# Altium schematic sheet Inverter.SchDoc (part 2 of 2)
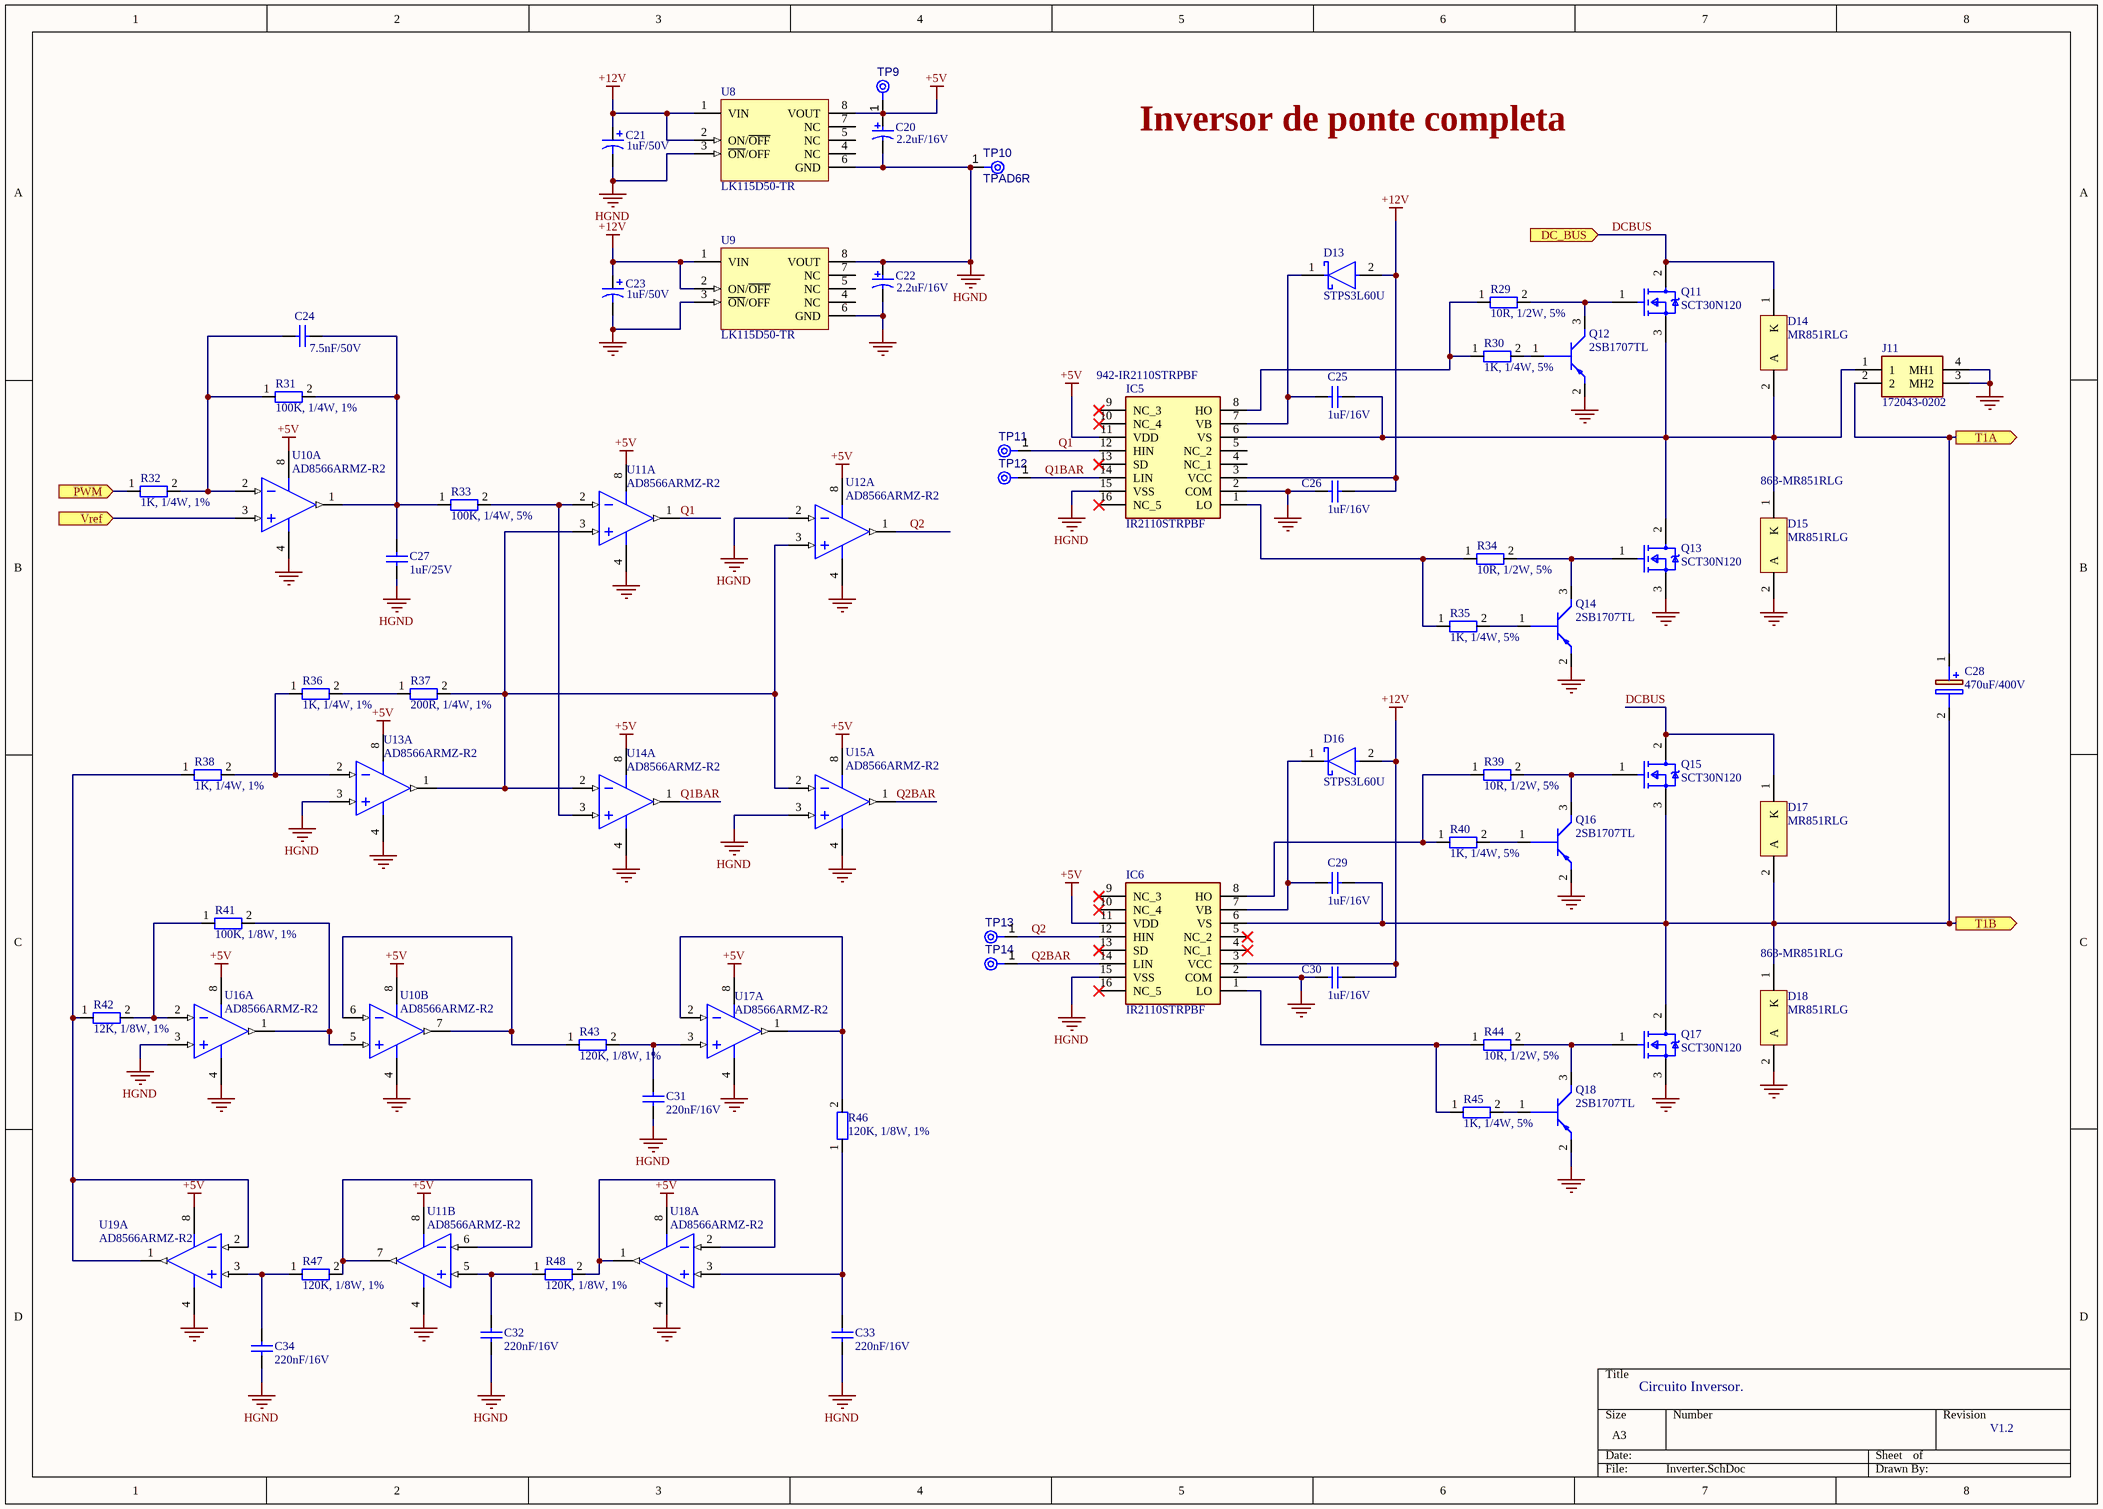
[diagram p1: Inverter.SchDoc]

## Library data of the parts
C20 C22 = CMP-2000-07187-1: Tantalum Capacitor, 2.2 uF, +/- 10%, 16 V, -55 to 125 degC, 2-Pin SMD, RoHS, Tape and Reel; Manufacturer: Kemet; Manufacturer Part Number: T491A225K016AT; Capacitance: 2200000pF; Product Depth (mm): 1.6mm; DCL: 0.4uA; Wire Form: NotRequired; Case Style: Molded; ESR: 6ohm; Polarity: Polar; Product Length (mm): 3.2mm; Voltage: 16VDC; Lead Spacing (nom): NotRequiredmm; DF: 6%; Rad Hardened: No; ESR (Equivalent Series Resistance): 6R; Voltage Rating: 16V; Life (Hours): 2000Hour; Leakage Current: 500nA; Operating Temp Range: -55Cto125C; Datasheet Version: 10/2016; Packaging: TapeandReel; Mounting Style: SurfaceMount; Manufacturer URL: http://www.kemet.com/; Seal: NotRequired; Product Height (mm): 1.6mm; Construction: SMTChip; Length W/Weld: NotRequiredmm; Package Reference: T491-A; Package Description: 2-Pin Surface Mount Device, Body 3.2 x 1.6 mm; Tolerance (+ or -): 10%; Length W/Weld (max): NotRequiredmm; Insulation: NotRequired; Mounting Technology: SurfaceMount; Package / Case: 3216-18; Seated Plane Height: NotRequiredmm; Case Code: A; Datasheet URL: http://capacitoredge.kemet.com/capedge2/DataSheet/Datasheet-T491A225K016AT.pdf?pn=T491A225K016AT; Product Diameter (mm): NotRequiredmm; Failure Rate: NotRequired; Supplier 1: Mouser; Supplier Part Number 1: 80-T491A225K016; RoHS: Yes; Category: Tantalum Capacitors; Stock 1: 27935; Pricing 1: 1=0.38000, 10=0.22000, 50=0.22000, 100=0.13300, 1000=0.10900, 10000=0.08000 (USD); Mount: Surface Mount,PCB; Case/Package: 1206; Number of Pins: 2; Case Code (Metric): 3216; Case Code (Imperial): 1206; Dielectric Material: Tantalum; Min Operating Temperature: -55°C; Max Operating Temperature: 125°C; Tolerance: 10%; Features: General Purpose; Dissipation Factor: 6%; Voltage Rating (DC): 16V; Termination: SMD/SMT; Package Quantity: 1; Length: 3.2mm; Width: 1.6mm; Height: 1.6mm; Depth: 1.6mm; Height - Seated (Max): 0.071inch; Radiation Hardening: No; Lead Free: Lead Free; RoHS Compliant: Yes; REACH SVHC: No SVHC; ComponentLink1URL: https://datasheet.ciiva.com/27052/1573329-27052562.pdf?src-supplier=Jameco; ComponentLink1Description: https://datasheet.ciiva.com/27052/1573329-27052562.pdf?src-supplier=Jameco; ComponentLink2URL: https://datasheet.ciiva.com/11793/0900766b80718482-11793333.pdf?src-supplier=RSComponents; ComponentLink2Description: https://datasheet.ciiva.com/11793/0900766b80718482-11793333.pdf?src-supplier=RSComponents; ComponentLink3URL: https://datasheet.ciiva.com/7696/1776109-7696304.pdf?src-supplier=Element14; ComponentLink3Description: https://datasheet.ciiva.com/7696/1776109-7696304.pdf?src-supplier=Element14; ComponentLink4URL: https://datasheet.ciiva.com/257/kem-t2005-t491-257413.pdf?src-supplier=Digi-Key; ComponentLink4Description: https://datasheet.ciiva.com/257/kem-t2005-t491-257413.pdf?src-supplier=Digi-Key; ComponentLink5URL: https://datasheet.ciiva.com/257/kem-t2005-t491-257414.pdf?src-supplier=Digi-Key; ComponentLink5Description: https://datasheet.ciiva.com/257/kem-t2005-t491-257414.pdf?src-supplier=Digi-Key; ComponentLink6URL: https://datasheet.ciiva.com/257/kem-t2005-t491-257415.pdf?src-supplier=Digi-Key; ComponentLink6Description: https://datasheet.ciiva.com/257/kem-t2005-t491-257415.pdf?src-supplier=Digi-Key; ComponentLink7URL: https://datasheet.ciiva.com/5934/1854511-5934533.pdf?src-supplier=Farnell; ComponentLink7Description: https://datasheet.ciiva.com/5934/1854511-5934533.pdf?src-supplier=Farnell; ComponentLink8URL: https://datasheet.ciiva.com/12910/kem-t2005-t491-12910990.pdf?src-supplier=Mouser; ComponentLink8Description: https://datasheet.ciiva.com/12910/kem-t2005-t491-12910990.pdf?src-supplier=Mouser; ComponentLink9URL: https://datasheet.ciiva.com/7696/1446014-7696302.pdf?src-supplier=Element14; ComponentLink9Description: https://datasheet.ciiva.com/7696/1446014-7696302.pdf?src-supplier=Element14; ComponentLink10URL: https://datasheet.ciiva.com/7696/1854511-7696303.pdf?src-supplier=Element14; ComponentLink10Description: https://datasheet.ciiva.com/7696/1854511-7696303.pdf?src-supplier=Element14; ComponentLink11URL: https://datasheet.ciiva.com/18095/getdatasheetpartid-120946-18095941.pdf?src-supplier=Verical; ComponentLink11Description: https://datasheet.ciiva.com/18095/getdatasheetpartid-120946-18095941.pdf?src-supplier=Verical
C21 C23 = Cap Pol1: KEMET         T491A105K050AT            Surface Mount Tantalum Capacitor, T491 Series, 1 F,  10%, 50 V, 1206 [3216 Metric], A; Capacitance: 1uF; ESR (Equivalent Series Resistance): 7R; Voltage Rating: 50V; Polarity: Polar; Dissipation Factor: 4%; Published: 8-Jun-2000; LatestRevisionDate: 17-Jul-2002; LatestRevisionNote: Re-released for DXP Platform.; PackageReference: RB7.6-15; Publisher: Altium Limited; PackageDescription: Polarized Capacitor (Radial); 2 Leads; Supplier 1: Mouser; Supplier Part Number 1: 80-T491A105K050AT; Manufacturer: KEMET; Manufacturer Part Number: T491A105K050AT; RoHS: Yes; Category: Tantalum Capacitors; Stock 1: 5526; Pricing 1: 1=0.86000, 10=0.53600, 50=0.53600, 100=0.37800, 1000=0.31600, 10000=0.24700 (USD); Case/Package: Molded; Case Code (Metric): 3216; Case Code (Imperial): 1206; Min Operating Temperature: -55°C; Max Operating Temperature: 125°C; Tolerance: 10%; Packaging: Cut Tape; Voltage Rating (DC): 50V; Length: 3.2mm; Depth: 1.6mm; REACH SVHC: No SVHC; Lead Free: Lead Free; RoHS Compliant: Yes; ComponentLink1URL: https://datasheet.ciiva.com/7972/1854511-7972911.pdf?src-supplier=Element14; ComponentLink1Description: https://datasheet.ciiva.com/7972/1854511-7972911.pdf?src-supplier=Element14
C24 = CMP-1036-04761-2: Manufacturer: Murata; Part Number: GRM21BR71H105KA12L; Manufacturer Part Number: C0805C752FAGAC7210; Capacitance: 7.5nF; Dielectric: C0G; Voltage Rating (DC): 250V; Tolerance: 1%; Supplier 1: Mouser; Supplier Part Number 1: 80-C0805C752FAG7210; RoHS: Yes; Category: Ceramic Capacitors; Case/Package: 0805; Case Code (Imperial): 0805; Case Code (Metric): 2012; Weight: 0.000194oz; Min Operating Temperature: -55°C; Max Operating Temperature: 125°C; Packaging: Tape and Reel; Termination: SMD/SMT; Package Quantity: 10000; Length: 2mm; Width: 1.2mm; RoHS Compliant: Yes; ComponentLink1URL: http://www.mouser.com/ds/2/212/KEM_C1003_C0G_SMD-356956.pdf?src-supplier=Mouser; ComponentLink1Description: http://www.mouser.com/ds/2/212/KEM_C1003_C0G_SMD-356956.pdf?src-supplier=Mouser
C25 C26 C29 C30 = CMP-2007-03241-1: Part Number: C0805C105Z4VACTU; Manufacturer: Kemet; Dielectric Material: Ceramic; Capacitance: 1uF; Voltage Rating: 16V; Tolerance: 80%; Dielectric: Y5V; Dissipation Factor: 7%; Supplier 1: Digi-Key; Supplier Part Number 1: 399-8011-1-ND; Manufacturer Part Number: C0805C105Z4VACTU; RoHS: Yes; Category: Ceramic Capacitors; Stock 1: 2421; Pricing 1: 1=0.11000, 10=0.08100, 50=0.04580, 100=0.03800, 500=0.02666, 1000=0.02207 (USD); Mount: Surface Mount,PCB; Case/Package: 0805; Number of Pins: 2; Case Code (Metric): 2012; Case Code (Imperial): 0805; Contact Material: Tin; Min Operating Temperature: -30°C; Max Operating Temperature: 85°C; Package Quantity: 1; Packaging: Tape and Reel; Voltage Rating (DC): 16V; Termination: SMD/SMT; Voltage: 16V; Series: C; Construction: Flat; Length: 2mm; Width: 0.049inch; Height: 1.25mm; Thickness: 0.055inch; Lead Pitch: 0.75mm; Depth: 1.25mm; Radiation Hardening: No; REACH SVHC: No SVHC; Lead Free: Lead Free; RoHS Compliant: Yes; ComponentLink1URL: https://datasheet.ciiva.com/6074/1698780-6074369.pdf?src-supplier=Farnell; ComponentLink1Description: https://datasheet.ciiva.com/6074/1698780-6074369.pdf?src-supplier=Farnell; ComponentLink2URL: https://datasheet.ciiva.com/16623/datasheetpn-c0805c105z4vac7800-16623623.pdf?src-supplier=Avnet+Europe; ComponentLink2Description: https://datasheet.ciiva.com/16623/datasheetpn-c0805c105z4vac7800-16623623.pdf?src-supplier=Avnet+Europe; ComponentLink3URL: https://datasheet.ciiva.com/14589/70095383-14589407.pdf?src-supplier=Allied+Electronics; ComponentLink3Description: https://datasheet.ciiva.com/14589/70095383-14589407.pdf?src-supplier=Allied+Electronics; ComponentLink4URL: https://datasheet.ciiva.com/7600/1698780-7600029.pdf?src-supplier=Newark; ComponentLink4Description: https://datasheet.ciiva.com/7600/1698780-7600029.pdf?src-supplier=Newark; ComponentLink5URL: https://datasheet.ciiva.com/14604/70095383-14604106.pdf?src-supplier=Allied+Electronics; ComponentLink5Description: https://datasheet.ciiva.com/14604/70095383-14604106.pdf?src-supplier=Allied+Electronics
C27 = CMP-1036-04761-2: Manufacturer: KEMET; Manufacturer Part Number: C0805C302K3GACTU; Dielectric Material: Ceramic; Capacitance: 3nF; Voltage Rating: 25V; Tolerance: 10%; Dielectric: C0G; Supplier 1: Newark; Supplier Part Number 1: 32K4910; RoHS: Yes; Category: Ceramic Capacitors; Pricing 1: 4000=0.15300, 8000=0.14600, 16000=0.14100, 24000=0.13600 (USD); Mount: Surface Mount; Case/Package: 0805; Case Code (Imperial): 0805; Case Code (Metric): 2012; Weight: 0.000194oz; Min Operating Temperature: -55°C; Max Operating Temperature: 125°C; Package Quantity: 4000; Packaging: Tape and Reel; Voltage Rating (DC): 25V; Termination: SMD/SMT; Series: C; Length: 2mm; Width: 1.25mm; Height: 0.9mm; Thickness: 0.039inch; Depth: 1.25mm; Lead Free: Lead Free; RoHS Compliant: Yes; ComponentLink1URL: http://www.mouser.com/ds/2/212/KEM_C1003_C0G_SMD-1101588.pdf?src-supplier=Mouser; ComponentLink1Description: http://www.mouser.com/ds/2/212/KEM_C1003_C0G_SMD-1101588.pdf?src-supplier=Mouser; ComponentLink2URL: http://components.arrow.com/part/dataview/3397846S8614754N7429?src-supplier=Arrow+Electronics; ComponentLink2Description: http://components.arrow.com/part/dataview/3397846S8614754N7429?src-supplier=Arrow+Electronics; ComponentLink3URL: https://search.kemet.com/component-edge/download/datasheet/C0805C302K3GACTU.pdf?src-supplier=Digi-Key; ComponentLink3Description: https://search.kemet.com/component-edge/download/datasheet/C0805C302K3GACTU.pdf?src-supplier=Digi-Key
C28 = MAL225966471E3: Capacitor Polarised; Manufacturer_Name: Vishay; Datasheet Link: https://ms.componentsearchengine.com/Datasheets/2/MAL225966471E3.pdf; Height: 37mm; Manufacturer_Part_Number: MAL225966471E3; Mouser Part Number: 594-MAL225966471E3; Mouser Price/Stock: https://www.mouser.co.uk/ProductDetail/Vishay-BC-Components/MAL225966471E3?qs=r5DSvlrkXmJ9zh5giZ1tYQ%3D%3D; Supplier 1: Mouser; Supplier Part Number 1: 594-MAL225966471E3; Manufacturer: Vishay; Manufacturer Part Number: MAL225966471E3; RoHS: Yes; Category: Aluminum Electrolytic Capacitors; Stock 1: 383; Pricing 1: 1=10.14000, 10=9.64000, 50=8.11000, 100=7.60000, 1000=6.33000, 10000=6.33000 (USD); RoHS Compliant: Yes
C31-C34 = CMP-1036-04761-2: Manufacturer: Murata; Part Number: GRM21BR71H105KA12L
D13 D16 = CMP-12187-000023-1: DIODE SCHOTTKY 60V 3A SMB; Manufacturer: STMicroelectronics; Standoff Height: 0.05mm; Peak Reverse Current: 150uA; Max Junction Temp: +150°C; Max Surge Forward Current: 100A; Element Configuration: Single; Forward Voltage: 790mV; Polarity: Standard; Octopart: https://octopart.com/stps3l60u-stmicroelectronics-334329; Category: Diode; Height: 2.65mm; RoHS: TRUE; Mouser Description: Schottky diode Configuration: Single Housing type: DO-214AA=SMB Peak conducting-state current: 100 A; Forward Current: 3A; Manufacturer Part Number: STPS3L60U; Temperature: to +150°C; ComponentLink2URL: https://www.st.com/resource/en/datasheet/stps3l60.pdf; Max Repetitive Reverse Voltage: 60V; Device Class L1: Discrete Semiconductors; Automotive: No; Device Class L3: Schottky Diodes; Digikey Description: DIODE SCHOTTKY 60V 3A SMB; Lead Free: Yes; Temperature Range High: +150°C; Package: SMB; ComponentLink2Description: Datasheet; Device Class L2: Diodes; Supplier 1: Mouser; Supplier Part Number 1: 511-STPS3L60U; Stock 1: 8303; Pricing 1: 1=0.43000, 10=0.33000, 50=0.33000, 100=0.20200, 1000=0.11900, 10000=0.10200 (USD); Mount: Surface Mount; Case/Package: SMB; Number of Pins: 2; Min Operating Temperature: -65°C; Max Operating Temperature: 150°C; Max Reverse Current: 150uA; Peak Non-Repetitive Surge Current: 100A; Max Repetitive Reverse Voltage (Vrrm): 60V; Packaging: Tape and Reel; Package Quantity: 1; Average Rectified Current: 3A; Max Reverse Voltage (DC): 60V; Max Reverse Leakage Current: 150uA; Max Forward Surge Current (Ifsm): 100A; Series: -; Max Surge Current: 100A; Voltage Rating (DC): 60V; Output Current: 3A; Current Rating: 3A; Length: 4.6mm; Width: 3.95mm; Radiation Hardening: No; RoHS Compliant: Yes; REACH SVHC: No SVHC; ComponentLink1URL: https://datasheet.ciiva.com/14178/cd00002286-14178423.pdf?src-supplier=Distrelec; ComponentLink1Description: https://datasheet.ciiva.com/14178/cd00002286-14178423.pdf?src-supplier=Distrelec; ComponentLink3URL: https://datasheet.ciiva.com/26788/stps3l60u-26788715.pdf?src-supplier=IIIC; ComponentLink3Description: https://datasheet.ciiva.com/26788/stps3l60u-26788715.pdf?src-supplier=IIIC; ComponentLink4URL: https://datasheet.ciiva.com/916/cd00002286-916102.pdf?src-supplier=Digi-Key; ComponentLink4Description: https://datasheet.ciiva.com/916/cd00002286-916102.pdf?src-supplier=Digi-Key; ComponentLink5URL: https://datasheet.ciiva.com/916/cd00002286-916103.pdf?src-supplier=Digi-Key; ComponentLink5Description: https://datasheet.ciiva.com/916/cd00002286-916103.pdf?src-supplier=Digi-Key; ComponentLink6URL: https://datasheet.ciiva.com/916/cd00002286-916104.pdf?src-supplier=Digi-Key; ComponentLink6Description: https://datasheet.ciiva.com/916/cd00002286-916104.pdf?src-supplier=Digi-Key; ComponentLink7URL: https://datasheet.ciiva.com/16491/cd00002286-16491535.pdf?src-supplier=Future+Electronics; ComponentLink7Description: https://datasheet.ciiva.com/16491/cd00002286-16491535.pdf?src-supplier=Future+Electronics; ComponentLink8URL: https://datasheet.ciiva.com/7963/1671123-7963959.pdf?src-supplier=Element14; ComponentLink8Description: https://datasheet.ciiva.com/7963/1671123-7963959.pdf?src-supplier=Element14; ComponentLink9URL: https://datasheet.ciiva.com/7963/1671123-7963960.pdf?src-supplier=Element14; ComponentLink9Description: https://datasheet.ciiva.com/7963/1671123-7963960.pdf?src-supplier=Element14; ComponentLink10URL: https://datasheet.ciiva.com/14560/70014075-14560118.pdf?src-supplier=Allied+Electronics; ComponentLink10Description: https://datasheet.ciiva.com/14560/70014075-14560118.pdf?src-supplier=Allied+Electronics
D14 D15 D17 D18 = CMP-0902-00056-1: Fast Recovery Rectifier, 2-Pin Axial_Lead, Pb-Free, Tape and Reel; Manufacturer: On Semiconductor; IO(rec) Max (A): 3; VRRM Max (V): 100; Max Surge Current: 100A; Max Reverse Current: 10uA; Forward Voltage: 1.25V; Recovery Time: 300ns; Forward Current: 3A; Max Repetitive Reverse Voltage (Vrrm): 100V; Element Configuration: Single; Polarity: Standard; ComponentLink1URL: http://www.onsemi.com/; PartNumber: MR851RLG; ComponentLink1Description: Manufacturer URL; ComponentLink2URL: http://www.onsemi.com/pub_link/Collateral/MR850-D.PDF; DatasheetVersion: Rev. 6; PackageDescription: 2-Pin, Axial Lead, Diameter 5.05 mm; ComponentLink3URL: http://www.onsemi.com/pub_link/Collateral/267-05.PDF; Type: Fast Recovery; IFSM Max (A): 100; ComponentLink3Description: Package Specification; PackageReference: AXIAL_LEAD-2-267-05; RoHS: TRUE; Mounting Technology: Through Hole; ComponentLink2Description: Datasheet; Packing: Tape and Reel; PackageVersion: Rev. G, 06/2000; Supplier 1: Mouser; Manufacturer Part Number: MR851RLG; Category: Rectifier Diodes; Stock 1: 3652; Pricing 1: 1=0.49000, 10=0.34400, 50=0.34400, 100=0.17400, 1000=0.15400, 10000=0.09200 (USD); Case/Package: DO-201AD; Number of Pins: 2; Weight: 0.01lb; Contact Plating: Tin,Matte; Min Operating Temperature: -65°C; Max Operating Temperature: 125°C; Package Quantity: 1; Packaging: Tape and Reel; Average Rectified Current: 3A; Reverse Recovery Time: 300ns; Peak Non-Repetitive Surge Current: 100A; Max Forward Surge Current (Ifsm): 100A; Voltage Rating (DC): 100V; Current Rating: 3A; Output Current: 3A; Max Reverse Voltage (DC): 100V; Reverse Voltage: 100V; Series: -; Reverse Recovery Time-Max: 300ns; Diameter: 5.3mm; Length: 0.374inch; Width: 1inch; Height: 9.5mm; Radiation Hardening: No; REACH SVHC: No SVHC; Lead Free: Lead Free; Halogen Free: Halogen Free; ComponentLink4URL: https://datasheet.ciiva.com/30479/0900766b812212e7-30479531.pdf?src-supplier=RSComponents; ComponentLink4Description: https://datasheet.ciiva.com/30479/0900766b812212e7-30479531.pdf?src-supplier=RSComponents; ComponentLink5URL: https://datasheet.ciiva.com/7963/92108-7963073.pdf?src-supplier=Element14; ComponentLink5Description: https://datasheet.ciiva.com/7963/92108-7963073.pdf?src-supplier=Element14; ComponentLink6URL: https://datasheet.ciiva.com/923/mr850-d-923098.pdf?src-supplier=Digi-Key; ComponentLink6Description: https://datasheet.ciiva.com/923/mr850-d-923098.pdf?src-supplier=Digi-Key; ComponentLink7URL: https://datasheet.ciiva.com/923/mr850-d-923099.pdf?src-supplier=Digi-Key; ComponentLink7Description: https://datasheet.ciiva.com/923/mr850-d-923099.pdf?src-supplier=Digi-Key
  D14 D17: Supplier Part Number 1: 863-MR851RLG
IC5 IC6 = IR2110STRPBF: MOSFET Driver 500 Volt 2.5A 2 Output Hi/Lo Side Non Input Volt 16-Pin SOIC W; Manufacturer_Name: Infineon; Manufacturer: International Rectifier; Number of Outputs: 2; Max Supply Voltage: 20V; Min Supply Voltage: 10V; Max Power Dissipation: 1.25W; Turn-On Delay Time: 10ns; Max Supply Current: 340uA; Rise Time: 35ns; Propagation Delay: 150ns; Fall Time: 25ns; Turn-Off Delay Time: 94ns; Output Voltage: 520V; Datasheet Link: https://www.infineon.com/dgdl/Infineon-IR2110-DataSheet-v01_00-EN.pdf?fileId=5546d462533600a4015355c80333167e; Height: 2.65mm; Manufacturer_Part_Number: IR2110STRPBF; Mouser Part Number: 942-IR2110STRPBF; Mouser Price/Stock: https://www.mouser.co.uk/ProductDetail/Infineon-IR/IR2110STRPBF?qs=2r01AXMCG3P4pNuJUqFzxg%3D%3D; Arrow Part Number: IR2110STRPBF; Arrow Price/Stock: https://www.arrow.com/en/products/ir2110strpbf/infineon-technologies-ag; Supplier 1: Mouser; Manufacturer Part Number: IR2110STRPBF; RoHS: Yes; Category: Gate Drivers; Pricing 1: 1=2.60000, 10=2.20000, 50=2.20000, 100=1.54000, 1000=1.18000, 10000=1.18000 (USD); Mount: Surface Mount; Case/Package: SOIC; Number of Pins: 16; Min Operating Temperature: -40°C; Max Operating Temperature: 125°C; Packaging: Tape and Reel; Max Output Current: 2.5A; Package Quantity: 1000; Number of Drivers: 2; Power Dissipation: 1.25W; Series: -; Output Current: 2.5A; Nominal Supply Current: 340uA; Max Output Voltage: 20V; Min Output Voltage: 10V; Termination: SMD/SMT; Length: 10.5mm; Width: 7.6mm; Radiation Hardening: No; Lead Free: Lead Free; REACH SVHC: No SVHC; ComponentLink1URL: https://datasheet.ciiva.com/1952/ir2110-1952809.pdf?src-supplier=Digi-Key; ComponentLink1Description: https://datasheet.ciiva.com/1952/ir2110-1952809.pdf?src-supplier=Digi-Key; ComponentLink2URL: https://datasheet.ciiva.com/1952/ir2110-1952810.pdf?src-supplier=Digi-Key; ComponentLink2Description: https://datasheet.ciiva.com/1952/ir2110-1952810.pdf?src-supplier=Digi-Key; ComponentLink3URL: https://datasheet.ciiva.com/1952/ir2110-1952811.pdf?src-supplier=Digi-Key; ComponentLink3Description: https://datasheet.ciiva.com/1952/ir2110-1952811.pdf?src-supplier=Digi-Key; ComponentLink4URL: https://datasheet.ciiva.com/3226/ir2110-3226294.pdf?src-supplier=Avnet; ComponentLink4Description: https://datasheet.ciiva.com/3226/ir2110-3226294.pdf?src-supplier=Avnet; ComponentLink5URL: https://datasheet.ciiva.com/16298/ir2110-16298071.pdf?src-supplier=Future+Electronics; ComponentLink5Description: https://datasheet.ciiva.com/16298/ir2110-16298071.pdf?src-supplier=Future+Electronics; ComponentLink6URL: https://datasheet.ciiva.com/1499/81026-1499491.pdf?src-supplier=Element14; ComponentLink6Description: https://datasheet.ciiva.com/1499/81026-1499491.pdf?src-supplier=Element14; ComponentLink7URL: https://datasheet.ciiva.com/28366/81026-28366141.pdf?src-supplier=Element14; ComponentLink7Description: https://datasheet.ciiva.com/28366/81026-28366141.pdf?src-supplier=Element14; ComponentLink8URL: https://datasheet.ciiva.com/22694/81026-22694331.pdf?src-supplier=Element14; ComponentLink8Description: https://datasheet.ciiva.com/22694/81026-22694331.pdf?src-supplier=Element14
  IC6: Supplier Part Number 1: 942-IR2110STRPBF
J11 = 172043-0202: CONN HDR 2POS 7.50MM R/A SLDR; Manufacturer_Name: Molex; Number of Positions: 2; Voltage Rating: 600V; Current Rating: 30A; Pitch: 0.295inch; Datasheet Link: https://www.molex.com/pdm_docs/sd/1720430202_sd.pdf; Height: 11.68mm; Manufacturer_Part_Number: 172043-0202; Mouser Part Number: 538-172043-0202; Mouser Price/Stock: https://www.mouser.co.uk/ProductDetail/Molex/172043-0202?qs=AUG1J5sL7zJwcA2Oseq0RA%3D%3D; Supplier 1: Mouser; Supplier Part Number 1: 538-172043-0202; Manufacturer: Molex; Manufacturer Part Number: 1720430202; RoHS: Yes; Category: Cables and Wire; Stock 1: 939; Pricing 1: 1=2.21000, 10=1.89000, 50=1.89000, 100=1.56000, 1000=1.22000, 10000=1.08000 (USD); Mount: Through Hole; Number of Pins: 2; Color: Black; Contact Material: Copper; Contact Plating: Silver; Insulation Material: Polymer; Min Operating Temperature: -40°C; Max Operating Temperature: 125°C; Packaging: Tray; Number of Rows: 1; Termination: Solder; Fastening Type: Ramp; Orientation: Right Angle; Number of Circuits: 2; RoHS Compliant: Yes; ComponentLink1URL: https://www.mouser.com/ds/2/276/1720430202_PCB_HEADERS-704499.pdf?src-supplier=Mouser; ComponentLink1Description: https://www.mouser.com/ds/2/276/1720430202_PCB_HEADERS-704499.pdf?src-supplier=Mouser; ComponentLink2URL: http://www.molex.com/pdm_docs/sd/1720430202_sd.pdf?src-supplier=Avnet; ComponentLink2Description: http://www.molex.com/pdm_docs/sd/1720430202_sd.pdf?src-supplier=Avnet; ComponentLink3URL: http://www.literature.molex.com/SQLImages/kelmscott/Molex/PDF_Images/987650-1349.PDF?src-supplier=Digi-Key; ComponentLink3Description: http://www.literature.molex.com/SQLImages/kelmscott/Molex/PDF_Images/987650-1349.PDF?src-supplier=Digi-Key; ComponentLink4URL: http://www.molex.com/pdm_docs/sd/1720430202_sd.pdf?src-supplier=Digi-Key; ComponentLink4Description: http://www.molex.com/pdm_docs/sd/1720430202_sd.pdf?src-supplier=Digi-Key
Q11 Q13 Q15 Q17 = SCT30N120: Trans MOSFET N-CH 1.2KV 45A 3-Pin HIP-247 Tube; Manufacturer: STMicroelectronics; Continuous Drain Current (ID): 40A; Rds On Max: 100mR; Input Capacitance: 1.7nF; Max Power Dissipation: 270W; Gate to Source Voltage (Vgs): 25V; Element Configuration: Single; Number of Channels: 1; Drain to Source Resistance: 80mR; Fall Time: 28ns; Rise Time: 20ns; Turn-Off Delay Time: 45ns; Turn-On Delay Time: 19ns; Threshold Voltage: 2.6V; Power Dissipation: 175W; Supplier 1: Digi-Key; Manufacturer Part Number: SCT30N120; RoHS: Yes; Category: MOSFETs; Stock 1: 580; Pricing 1: 1=21.25000, 10=19.53200, 25=18.72200, 100=16.49560, 500=16.10000 (USD); Mount: Through Hole; Case/Package: TO-247-3; Number of Pins: 247; Weight: 1.340411oz; Min Operating Temperature: -55°C; Max Operating Temperature: 200°C; Drain to Source Voltage (Vdss): 1.2kV; Packaging: Rail/Tube; Drain to Source Breakdown Voltage: 1.2kV; Package Quantity: 30; Number of Elements: 1; Lead Free: Lead Free; REACH SVHC: No SVHC; ComponentLink1URL: https://datasheet.ciiva.com/46422/1856099-46422059.pdf?src-supplier=Element14; ComponentLink1Description: https://datasheet.ciiva.com/46422/1856099-46422059.pdf?src-supplier=Element14; Supplier Part Number 1: 497-14960-ND
Q12 Q14 Q16 Q18 = 2SB1707TL: TRANS PNP 12V 4A TSMT3; Manufacturer_Name: ROHM Semiconductor; Manufacturer: Rohm; Max Power Dissipation: 500mW; Collector Base Voltage (VCBO): -15V; hFE Min: 270; Transition Frequency: 250MHz; Emitter Base Voltage (VEBO): -6V; Collector Emitter Saturation Voltage: -150mV; Element Configuration: Single; Continuous Collector Current: -4A; Max Frequency: 100MHz; Voltage Rating (DC): -12V; Collector-emitter Voltage-Max: 250mV; Datasheet Link: https://fscdn.rohm.com/en/products/databook/datasheet/discrete/transistor/bipolar/2sb1707tl-e.pdf; Height: 1mm; Manufacturer_Part_Number: 2SB1707TL; Mouser Part Number: 755-2SB1707TL; Mouser Price/Stock: https://www.mouser.com/Search/Refine.aspx?Keyword=755-2SB1707TL; Supplier 1: Mouser; Supplier Part Number 1: 755-2SB1707TL; Manufacturer Part Number: 2SB1707TL; RoHS: Yes; Category: BJTs; Stock 1: 2939; Pricing 1: 1=0.69000, 10=0.57100, 50=0.57100, 100=0.34600, 1000=0.29500, 10000=0.25200 (USD); Mount: Surface Mount; Case/Package: TO-236-3; Number of Pins: 3; Contact Plating: Copper,Tin,Silver; Min Operating Temperature: -55°C; Max Operating Temperature: 150°C; Collector Emitter Voltage (VCEO): 12V; Max Collector Current: 4A; Packaging: Tape and Reel; Package Quantity: 3000; Polarity: PNP; Collector Emitter Breakdown Voltage: 12V; Max Breakdown Voltage: 12V; Gain Bandwidth Product: 250MHz; Current Rating: -4A; Series: -; Length: 2.9mm; Width: 1.6mm; Radiation Hardening: No; Lead Free: Lead Free; RoHS Compliant: Yes; ComponentLink1URL: https://datasheet.ciiva.com/978/2sb1707-978075.pdf?src-supplier=Digi-Key; ComponentLink1Description: https://datasheet.ciiva.com/978/2sb1707-978075.pdf?src-supplier=Digi-Key; ComponentLink2URL: https://datasheet.ciiva.com/11203/2sb1707-11203670.pdf?src-supplier=Avnet; ComponentLink2Description: https://datasheet.ciiva.com/11203/2sb1707-11203670.pdf?src-supplier=Avnet; ComponentLink3URL: https://datasheet.ciiva.com/16289/2sb1707-210615-16289360.pdf?src-supplier=Mouser; ComponentLink3Description: https://datasheet.ciiva.com/16289/2sb1707-210615-16289360.pdf?src-supplier=Mouser; ComponentLink4URL: https://datasheet.ciiva.com/978/2sb1707-978076.pdf?src-supplier=Digi-Key; ComponentLink4Description: https://datasheet.ciiva.com/978/2sb1707-978076.pdf?src-supplier=Digi-Key; ComponentLink5URL: https://datasheet.ciiva.com/978/2sb1707-978077.pdf?src-supplier=Digi-Key; ComponentLink5Description: https://datasheet.ciiva.com/978/2sb1707-978077.pdf?src-supplier=Digi-Key
R29 R34 R39 R44 = RES-1206: Res Thick Film 0805 10 Ohm 5% 0.5W(1/2W) +/-200ppm/C Pad SMD Automotive T/R; Manufacturer: Vishay Dale; Manufacturer Part Number: CRCW080510R0JNEAHP; Temperature Coefficient: 200ppm/°C; Power Rating: 330mW; Voltage Rating: 150V; Max Power Dissipation: 333mW; Supplier 1: Mouser; Supplier Part Number 1: 71-CRCW080510R0JNEAH; RoHS: Yes; Category: Chip SMD Resistors; Stock 1: 4777; Pricing 1: 1=0.23000, 10=0.20300, 50=0.20300, 100=0.07900, 1000=0.03000, 10000=0.02700 (USD); Mount: Surface Mount; Case/Package: 0805; Contact Plating: Tin; Weight: 0.000194oz; Case Code (Metric): 2012; Case Code (Imperial): 0805; Min Operating Temperature: -55°C; Max Operating Temperature: 155°C; Resistance: 10R; Tolerance: 5%; Resistor Type: Thick Film; Packaging: Tape and Reel; Package Quantity: 1; Number of Terminations: 2; Features: Automotive AEC-Q200; Series: CRCW-HP; Construction: Rectangular; Length: 2mm; Width: 0.049inch; Height: 0.024inch; Depth: 1.25mm; Radiation Hardening: No; Military Standard: Not; Lead Free: Lead Free; RoHS Compliant: Yes; ComponentLink1URL: https://datasheet.ciiva.com/2499/crcwhpe3-2499490.pdf?src-supplier=Digi-Key; ComponentLink1Description: https://datasheet.ciiva.com/2499/crcwhpe3-2499490.pdf?src-supplier=Digi-Key; ComponentLink2URL: https://datasheet.ciiva.com/2499/crcwhpe3-2499491.pdf?src-supplier=Digi-Key; ComponentLink2Description: https://datasheet.ciiva.com/2499/crcwhpe3-2499491.pdf?src-supplier=Digi-Key; ComponentLink3URL: https://datasheet.ciiva.com/2499/crcwhpe3-2499492.pdf?src-supplier=Digi-Key; ComponentLink3Description: https://datasheet.ciiva.com/2499/crcwhpe3-2499492.pdf?src-supplier=Digi-Key; ComponentLink4URL: https://datasheet.ciiva.com/5562/crcwhpe3-46056-5562181.pdf?src-supplier=Mouser; ComponentLink4Description: https://datasheet.ciiva.com/5562/crcwhpe3-46056-5562181.pdf?src-supplier=Mouser; ComponentLink5URL: https://datasheet.ciiva.com/9050/crcwhpe3-9050566.pdf?src-supplier=Avnet; ComponentLink5Description: https://datasheet.ciiva.com/9050/crcwhpe3-9050566.pdf?src-supplier=Avnet
R30 R35 R40 R45 = Res-0805: Res Thick Film 0805 1K Ohm 5% 1/8W 100ppm/C Molded SMD SMD Paper T/R; Manufacturer_Name: YAGEO (PHYCOMP); Manufacturer_Part_Number: RC0805JR-131KL; Manufacturer: Yageo; Resistance: 1kR; Temperature Coefficient: 100ppm/°C; Power Rating: 125mW; Voltage Rating: 150V; Datasheet Link: http://www.yageo.com/documents/recent/PYu-RC_Group_51_RoHS_L_10.pdf; Height: 0.6mm; Mouser Part Number: 603-RC0805JR-131KL; Mouser Price/Stock: https://www.mouser.com/Search/Refine.aspx?Keyword=603-RC0805JR-131KL; Supplier 1: Mouser; Supplier Part Number 1: 603-RC0805JR-131KL; Manufacturer Part Number: RC0805JR-131KL; RoHS: Yes; Category: Chip SMD Resistors; Stock 1: 6435; Pricing 1: 1=0.11000, 10=0.02600, 50=0.02600, 100=0.00900, 1000=0.00700, 10000=0.00500 (USD); Case/Package: 0805; Number of Pins: 2; Contact Plating: Tin,Lead,Matte; Case Code (Imperial): 0805; Case Code (Metric): 2012; Size Code: 0805; Min Operating Temperature: -55°C; Max Operating Temperature: 155°C; Tolerance: 5%; Resistor Type: Thick Film; Packaging: Tape and Reel; Termination: SMD/SMT; Voltage Rating (DC): 150V; Series: RC; Construction: Rectangular; Resistance Tolerance: 5%; Length: 2mm; Width: 1.25mm; Depth: 1.25mm; Radiation Hardening: No; RoHS Compliant: Yes; REACH SVHC: No SVHC; Military Standard: Not; Lead Free: Lead Free; ComponentLink1URL: https://datasheet.ciiva.com/12560/rc0805-257173-12560870.pdf?src-supplier=Mouser; ComponentLink1Description: https://datasheet.ciiva.com/12560/rc0805-257173-12560870.pdf?src-supplier=Mouser; ComponentLink2URL: https://datasheet.ciiva.com/17333/rc0805-17333917.pdf?src-supplier=Future+Electronics; ComponentLink2Description: https://datasheet.ciiva.com/17333/rc0805-17333917.pdf?src-supplier=Future+Electronics; ComponentLink3URL: https://datasheet.ciiva.com/7983/444164-7983797.pdf?src-supplier=Element14; ComponentLink3Description: https://datasheet.ciiva.com/7983/444164-7983797.pdf?src-supplier=Element14
R31 R33 R41 = Res-0805: Thick Film Resistors 100K OHM 1%; Manufacturer_Name: YAGEO (PHYCOMP); Manufacturer_Part_Number: RC0805JR-131KL; Manufacturer: Yageo; Manufacturer Part Number: RC0805FR-13100KL; Resistance: 100kR; Temperature Coefficient: 100ppm/°C; Power Rating: 125mW; Voltage Rating: 150V; Datasheet Link: http://www.yageo.com/documents/recent/PYu-RC_Group_51_RoHS_L_10.pdf; Height: 0.6mm; Mouser Part Number: 603-RC0805JR-131KL; Mouser Price/Stock: https://www.mouser.com/Search/Refine.aspx?Keyword=603-RC0805JR-131KL; Supplier 1: Mouser; Supplier Part Number 1: 603-RC0805FR-13100KL; RoHS: Yes; Category: Chip SMD Resistors; Stock 1: 57591; Pricing 1: 1=0.13000, 10=0.03100, 50=0.03100, 100=0.01100, 1000=0.00800, 10000=0.00500 (USD); Case/Package: 0805; Contact Plating: Tin,Lead,Matte; Case Code (Imperial): 0805; Case Code (Metric): 2012; Size Code: 0805; Min Operating Temperature: -55°C; Max Operating Temperature: 155°C; Tolerance: 1%; Resistor Type: Thick Film; Packaging: Tape and Reel; Termination: SMD/SMT; Series: RC; Radiation Hardening: No; Lead Free: Lead Free; RoHS Compliant: Yes; ComponentLink1URL: https://datasheet.ciiva.com/5558/rc0805-5558047.pdf?src-supplier=Mouser; ComponentLink1Description: https://datasheet.ciiva.com/5558/rc0805-5558047.pdf?src-supplier=Mouser
R32 R36 R38 = Res-0805: Res Thick Film 0805 1K Ohm 1% 1/8W 100ppm/C Molded SMD SMD Paper T/R; Manufacturer_Name: YAGEO (PHYCOMP); Manufacturer_Part_Number: RC0805JR-131KL; Manufacturer: Yageo; Manufacturer Part Number: RC0805FR-101KL; Resistance: 1kR; Temperature Coefficient: 100ppm/°C; Power Rating: 125mW; Voltage Rating: 150V; Datasheet Link: http://www.yageo.com/documents/recent/PYu-RC_Group_51_RoHS_L_10.pdf; Height: 0.6mm; Mouser Part Number: 603-RC0805JR-131KL; Mouser Price/Stock: https://www.mouser.com/Search/Refine.aspx?Keyword=603-RC0805JR-131KL; Supplier 1: Mouser; Supplier Part Number 1: 603-RC0805FR-101KL; RoHS: Yes; Category: Chip SMD Resistors; Stock 1: 42279; Pricing 1: 1=0.13000, 10=0.03100, 50=0.03100, 100=0.01100, 1000=0.00800, 10000=0.00500 (USD); Case/Package: 0805; Contact Plating: Tin,Matte,Lead; Case Code (Imperial): 0805; Case Code (Metric): 2012; Min Operating Temperature: -55°C; Max Operating Temperature: 155°C; Tolerance: 1%; Resistor Type: Thick Film; Packaging: Tape and Reel; Termination: SMD/SMT; Voltage Rating (DC): 150V; Series: RC; Resistance Tolerance: 1%; Construction: Rectangular; Length: 2mm; Width: 1.25mm; Depth: 1.25mm; Radiation Hardening: No; REACH SVHC: No SVHC; Military Standard: Not; RoHS Compliant: Yes; ComponentLink1URL: https://datasheet.ciiva.com/12561/rc0805-257173-12561685.pdf?src-supplier=Mouser; ComponentLink1Description: https://datasheet.ciiva.com/12561/rc0805-257173-12561685.pdf?src-supplier=Mouser; ComponentLink2URL: https://datasheet.ciiva.com/7983/444164-7983758.pdf?src-supplier=Element14; ComponentLink2Description: https://datasheet.ciiva.com/7983/444164-7983758.pdf?src-supplier=Element14
R37 = Res-0805: Res Thick Film 2.0 x 1.2 mm 200 Ohm 1% 0.125W(1/8W) 100ppm/ C Molded SMD Paper T/R; Manufacturer_Name: YAGEO (PHYCOMP); Manufacturer_Part_Number: RC0805JR-131KL; Manufacturer: Yageo; Manufacturer Part Number: RC0805FR-07200RL; Temperature Coefficient: 100ppm/°C; Voltage Rating (DC): 150V; Power Rating: 125mW; Datasheet Link: http://www.yageo.com/documents/recent/PYu-RC_Group_51_RoHS_L_10.pdf; Height: 0.6mm; Mouser Part Number: 603-RC0805JR-131KL; Mouser Price/Stock: https://www.mouser.com/Search/Refine.aspx?Keyword=603-RC0805JR-131KL; Supplier 1: Mouser; Supplier Part Number 1: 603-RC0805FR-07200RL; RoHS: Yes; Category: Chip SMD Resistors; Stock 1: 137491; Pricing 1: 1=0.10000, 10=0.03500, 50=0.03500, 100=0.01200, 1000=0.00700, 10000=0.00400 (USD); Mount: Surface Mount; Case/Package: 0805; Case Code (Metric): 2012; Case Code (Imperial): 0805; Size Code: 0805; Min Operating Temperature: -55°C; Max Operating Temperature: 155°C; Tolerance: 1%; Resistance: 200R; Resistor Type: Thick Film; Packaging: Tape and Reel; Package Quantity: 1; Voltage Rating: 150V; Number of Terminations: 2; Termination: SMD/SMT; Max Power Dissipation: 125mW; Features: Moisture Resistant; Series: RC; Construction: Rectangular; Length: 2mm; Width: 0.049inch; Depth: 1.25mm; Lead Free: Lead Free; Military Standard: Not; RoHS Compliant: Yes; ComponentLink1URL: https://datasheet.ciiva.com/12667/rc0805-12667066.pdf?src-supplier=Mouser; ComponentLink1Description: https://datasheet.ciiva.com/12667/rc0805-12667066.pdf?src-supplier=Mouser; ComponentLink2URL: https://datasheet.ciiva.com/2519/pyu-r-int-thick-7-2519720.pdf?src-supplier=Digi-Key; ComponentLink2Description: https://datasheet.ciiva.com/2519/pyu-r-int-thick-7-2519720.pdf?src-supplier=Digi-Key; ComponentLink3URL: https://datasheet.ciiva.com/2519/pyu-r-int-thick-7-2519721.pdf?src-supplier=Digi-Key; ComponentLink3Description: https://datasheet.ciiva.com/2519/pyu-r-int-thick-7-2519721.pdf?src-supplier=Digi-Key; ComponentLink4URL: https://datasheet.ciiva.com/2519/pyu-r-int-thick-7-2519722.pdf?src-supplier=Digi-Key; ComponentLink4Description: https://datasheet.ciiva.com/2519/pyu-r-int-thick-7-2519722.pdf?src-supplier=Digi-Key; ComponentLink5URL: https://datasheet.ciiva.com/15189/getdatasheetpartid-327982-15189926.pdf?src-supplier=Verical; ComponentLink5Description: https://datasheet.ciiva.com/15189/getdatasheetpartid-327982-15189926.pdf?src-supplier=Verical
R42 = Res-0805: Res Thick Film 0805 12K Ohm 1% 0.125W(1/8W) ±100ppm/C Molded SMD Paper T/R; Manufacturer_Name: YAGEO (PHYCOMP); Manufacturer_Part_Number: RC0805JR-131KL; Manufacturer: Yageo; Manufacturer Part Number: RC0805FR-0712KL; Resistance: 12kR; Temperature Coefficient: 100ppm/°C; Power Rating: 125mW; Voltage Rating: 150V; Datasheet Link: http://www.yageo.com/documents/recent/PYu-RC_Group_51_RoHS_L_10.pdf; Height: 0.6mm; Mouser Part Number: 603-RC0805JR-131KL; Mouser Price/Stock: https://www.mouser.com/Search/Refine.aspx?Keyword=603-RC0805JR-131KL; Supplier 1: Mouser; Supplier Part Number 1: 603-RC0805FR-0712KL; RoHS: Yes; Category: Chip SMD Resistors; Stock 1: 94553; Pricing 1: 1=0.13000, 10=0.03100, 50=0.03100, 100=0.01100, 1000=0.00800, 10000=0.00500 (USD); Case/Package: 0805; Case Code (Imperial): 0805; Case Code (Metric): 2012; Weight: 0.000194oz; Size Code: 0805; Min Operating Temperature: -55°C; Max Operating Temperature: 155°C; Tolerance: 1%; Resistor Type: Thick Film; Packaging: Tape and Reel; Package Quantity: 1; Termination: SMD/SMT; Number of Terminations: 2; Max Power Dissipation: 125mW; Features: Moisture Resistant; Series: RC; Resistance Tolerance: 1%; Construction: Rectangular; Length: 2mm; Width: 1.25mm; Depth: 1.25mm; REACH SVHC: Unknown; Lead Free: Lead Free; Military Standard: Not; RoHS Compliant: Yes; ComponentLink1URL: https://datasheet.ciiva.com/2519/pyu-r-int-thick-7-2519831.pdf?src-supplier=Digi-Key; ComponentLink1Description: https://datasheet.ciiva.com/2519/pyu-r-int-thick-7-2519831.pdf?src-supplier=Digi-Key; ComponentLink2URL: https://datasheet.ciiva.com/2519/pyu-r-int-thick-7-2519832.pdf?src-supplier=Digi-Key; ComponentLink2Description: https://datasheet.ciiva.com/2519/pyu-r-int-thick-7-2519832.pdf?src-supplier=Digi-Key; ComponentLink3URL: https://datasheet.ciiva.com/2519/pyu-r-int-thick-7-2519833.pdf?src-supplier=Digi-Key; ComponentLink3Description: https://datasheet.ciiva.com/2519/pyu-r-int-thick-7-2519833.pdf?src-supplier=Digi-Key; ComponentLink4URL: https://datasheet.ciiva.com/12577/rc0805-12577253.pdf?src-supplier=Mouser; ComponentLink4Description: https://datasheet.ciiva.com/12577/rc0805-12577253.pdf?src-supplier=Mouser; ComponentLink5URL: https://datasheet.ciiva.com/17018/rc0805-17018634.pdf?src-supplier=Future+Electronics; ComponentLink5Description: https://datasheet.ciiva.com/17018/rc0805-17018634.pdf?src-supplier=Future+Electronics; ComponentLink6URL: https://datasheet.ciiva.com/7941/444164-7941693.pdf?src-supplier=Element14; ComponentLink6Description: https://datasheet.ciiva.com/7941/444164-7941693.pdf?src-supplier=Element14; ComponentLink7URL: https://datasheet.ciiva.com/7941/444164-7941694.pdf?src-supplier=Element14; ComponentLink7Description: https://datasheet.ciiva.com/7941/444164-7941694.pdf?src-supplier=Element14
R43 R46-R48 = Res-0805: YAGEO - RC0805FR-07120KL - RES, 120K, 1%, 0.125W, 0805, THICK FILM; Manufacturer_Name: YAGEO (PHYCOMP); Manufacturer_Part_Number: RC0805JR-131KL; Resistance: 120kR; Temperature Coefficient: 100ppm/°C; Power Rating: 125mW; Voltage Rating: 150V; Datasheet Link: http://www.yageo.com/documents/recent/PYu-RC_Group_51_RoHS_L_10.pdf; Height: 0.6mm; Mouser Part Number: 603-RC0805JR-131KL; Mouser Price/Stock: https://www.mouser.com/Search/Refine.aspx?Keyword=603-RC0805JR-131KL; Supplier 1: Mouser; Supplier Part Number 1: 603-RC0805FR-07120KL; Manufacturer: Yageo; Manufacturer Part Number: RC0805FR-07120KL; RoHS: Yes; Category: Chip SMD Resistors; Stock 1: 123823; Pricing 1: 1=0.10000, 10=0.03100, 50=0.03100, 100=0.01200, 1000=0.00700, 10000=0.00400 (USD); Case/Package: 0805; Contact Plating: Tin,Matte; Case Code (Metric): 2012; Case Code (Imperial): 0805; Weight: 0.000194oz; Size Code: 0805; Min Operating Temperature: -55°C; Max Operating Temperature: 155°C; Tolerance: 1%; Resistor Type: Thick Film; Package Quantity: 1; Packaging: Tape and Reel; Number of Terminations: 2; Termination: SMD/SMT; Max Power Dissipation: 125mW; Features: Moisture Resistant; Series: RC; Construction: Rectangular; Resistance Tolerance: 1%; Length: 2mm; Width: 0.049inch; Depth: 1.25mm; Radiation Hardening: No; REACH SVHC: Unknown; Military Standard: Not; Lead Free: Lead Free; RoHS Compliant: Yes; ComponentLink1URL: https://datasheet.ciiva.com/2457/pyu-r-int-thick-7-2457029.pdf?src-supplier=Digi-Key; ComponentLink1Description: https://datasheet.ciiva.com/2457/pyu-r-int-thick-7-2457029.pdf?src-supplier=Digi-Key; ComponentLink2URL: https://datasheet.ciiva.com/2457/pyu-r-int-thick-7-2457030.pdf?src-supplier=Digi-Key; ComponentLink2Description: https://datasheet.ciiva.com/2457/pyu-r-int-thick-7-2457030.pdf?src-supplier=Digi-Key; ComponentLink3URL: https://datasheet.ciiva.com/2457/pyu-r-int-thick-7-2457031.pdf?src-supplier=Digi-Key; ComponentLink3Description: https://datasheet.ciiva.com/2457/pyu-r-int-thick-7-2457031.pdf?src-supplier=Digi-Key; ComponentLink4URL: https://datasheet.ciiva.com/12577/rc0805-12577303.pdf?src-supplier=Mouser; ComponentLink4Description: https://datasheet.ciiva.com/12577/rc0805-12577303.pdf?src-supplier=Mouser; ComponentLink5URL: https://datasheet.ciiva.com/15189/getdatasheetpartid-328115-15189894.pdf?src-supplier=Verical; ComponentLink5Description: https://datasheet.ciiva.com/15189/getdatasheetpartid-328115-15189894.pdf?src-supplier=Verical; ComponentLink6URL: https://datasheet.ciiva.com/7941/444164-7941689.pdf?src-supplier=Element14; ComponentLink6Description: https://datasheet.ciiva.com/7941/444164-7941689.pdf?src-supplier=Element14; ComponentLink7URL: https://datasheet.ciiva.com/7941/444164-7941690.pdf?src-supplier=Element14; ComponentLink7Description: https://datasheet.ciiva.com/7941/444164-7941690.pdf?src-supplier=Element14
TP9-TP14 = CMP-00028-00002-2: 0.6mm round; Pins: 1
U8 U9 = CMP-0244-00225-1: 100mA, Very Low Drop (0.2V) with Inhibit Voltage Regulator, 5V, 8-Pin SO, Tape and Reel; Manufacturer: STMicroelectronics; Max Input Voltage: 20V; Number of Outputs: 1; Quiescent Current: 500uA; Polarity: Positive; Accuracy: 3%; Output Type: Fixed; Dropout Voltage: 170mV; Min Input Voltage: 4.3V; Min Current Limit: 120mA; Input Bias Current: 280uA; ComponentLink2URL: http://www.st.com/internet/com/TECHNICAL_RESOURCES/TECHNICAL_LITERATURE/DATASHEET/CD00000547.pdf; ComponentLink2Description: Datasheet; PackageDescription: 8-Pin Small Outline Integrated Circuit 1.27 mm Pitch; DatasheetVersion: 1/07/2008; ComponentLink3Description: Package Specification; PackageReference: SO8; Code_IPC: SOIC127P600-8; ComponentLink1Description: Manufacturer URL; ComponentLink3URL: http://www.st.com/internet/com/TECHNICAL_RESOURCES/TECHNICAL_LITERATURE/PACKAGE_INFORMATION/CD00004680.pdf; PackageVersion: 1/12/2002; ComponentLink1URL: http://www.st.com; Code_JEDEC: MS-012-AA; Supplier 1: Mouser; Supplier Part Number 1: 511-LK115D50-TR; Manufacturer Part Number: LK115D50-TR; RoHS: Yes; Category: Voltage Regulators - Linear; Stock 1: 1552; Pricing 1: 1=0.71000, 10=0.58600, 50=0.55200, 100=0.51400, 1000=0.48200, 10000=0.45200 (USD); Mount: Surface Mount; Case/Package: SO; Number of Pins: 8; Min Operating Temperature: -40°C; Max Operating Temperature: 125°C; Max Output Current: 100mA; Output Voltage: 5V; Output Current: 100mA; Package Quantity: 1; Packaging: Tape and Reel; Nominal Output Voltage: 5V; Number of Regulators: 1; Min Output Voltage: 5V; Output Voltage Accuracy: 3%; Series: -; Length: 5mm; Width: 4mm; Height: 1.65mm; Radiation Hardening: No; REACH SVHC: No SVHC; Lead Free: Lead Free; ComponentLink4URL: https://datasheet.ciiva.com/1570/1802177-1570112.pdf?src-supplier=Farnell; ComponentLink4Description: https://datasheet.ciiva.com/1570/1802177-1570112.pdf?src-supplier=Farnell; ComponentLink5URL: https://datasheet.ciiva.com/30477/0900766b812940e8-30477252.pdf?src-supplier=RSComponents; ComponentLink5Description: https://datasheet.ciiva.com/30477/0900766b812940e8-30477252.pdf?src-supplier=RSComponents; ComponentLink6URL: https://datasheet.ciiva.com/41440/001184989-da-01-en-ic-reg-ldo-5v-0-1-lk115d50-tr-soic-8-stm-41440172.pdf?src-supplier=Conrad; ComponentLink6Description: https://datasheet.ciiva.com/41440/001184989-da-01-en-ic-reg-ldo-5v-0-1-lk115d50-tr-soic-8-stm-41440172.pdf?src-supplier=Conrad; ComponentLink7URL: https://datasheet.ciiva.com/2049/cd00000547-2049618.pdf?src-supplier=Digi-Key; ComponentLink7Description: https://datasheet.ciiva.com/2049/cd00000547-2049618.pdf?src-supplier=Digi-Key; ComponentLink8URL: https://datasheet.ciiva.com/2049/cd00000547-2049619.pdf?src-supplier=Digi-Key; ComponentLink8Description: https://datasheet.ciiva.com/2049/cd00000547-2049619.pdf?src-supplier=Digi-Key; ComponentLink9URL: https://datasheet.ciiva.com/2049/cd00000547-2049620.pdf?src-supplier=Digi-Key; ComponentLink9Description: https://datasheet.ciiva.com/2049/cd00000547-2049620.pdf?src-supplier=Digi-Key; ComponentLink10URL: https://datasheet.ciiva.com/3225/cd00000547-3225215.pdf?src-supplier=Avnet; ComponentLink10Description: https://datasheet.ciiva.com/3225/cd00000547-3225215.pdf?src-supplier=Avnet; ComponentLink11URL: https://datasheet.ciiva.com/1511/1802177-1511670.pdf?src-supplier=Element14; ComponentLink11Description: https://datasheet.ciiva.com/1511/1802177-1511670.pdf?src-supplier=Element14
U10-U19 = CMP-0384-01637-1: Double Channel Single-Supply Operation Operational Amplifier, 5 MHz BW, 6 V/us SR, Industrial, 8-pin SOP (RM-8), Reel; Manufacturer: Analog Devices; Generic Part Number: AD8566; Amplifiers Per Package: 2; Iq/Amp: 850uA; Slew Rate: 6V/us; Small Signal Bandwidth: 5MHz; V Span Max: 16V; Input Bias Current: 600nA; Input Offset Voltage: 2mV; Automotive Qualified: Yes; V Span Min: 4.5V; Voltage Gain: 80dB; Common Mode Rejection Ratio: 54dB; Operating Supply Current: 700uA; Output Current per Channel: 35mA; Input Voltage Noise Density: 26nV/sqrt Hz; Power Supply Rejection Ratio (PSRR): 90dB; Max Frequency: 10kHz; Input Capacitance: 1pF; Amplifier Type: GENERAL PURPOSE; DatasheetVersion: Rev. G; ComponentLink3Description: Package Specification; ComponentLink2Description: Datasheet; Code_JEDEC: MO-187-AA; PackageReference: RM-8; ComponentLink1URL: http://www.analog.com/en/index.html; PackageDescription: 8-Pin Mini Small Outline Package, Body 3 x 3 mm, Pitch 0.65 mm; Mounting Technology: Surface Mount; PartNumber: AD8566ARMZ-R2; ComponentLink3URL: http://www.analog.com/static/imported-files/packages/PKG_PDF/MSOP%28RM%29/RM_8.pdf; ComponentLink1Description: Manufacturer URL; ComponentLink2URL: http://www.analog.com/static/imported-files/data_sheets/AD8565_8566_8567.pdf; Supplier 1: Digi-Key; Supplier Part Number 1: AD8566ARMZ-R2CT-ND; Manufacturer Part Number: AD8566ARMZ-R2; RoHS: Yes; Category: Amplifiers - Op Amps, Buffer, Instrumentation; Pricing 1: 1=3.71000, 10=3.33400, 100=2.73160 (USD); Case/Package: MSOP; Number of Pins: 8; Min Operating Temperature: -40°C; Max Operating Temperature: 85°C; Min Supply Voltage: 4.5V; Max Supply Voltage: 16V; Gain Bandwidth Product: 5MHz; Packaging: Tape and Reel; Package Quantity: 250; Unity Gain Bandwidth Product: 5MHz; Bandwidth: 5MHz; Number of Circuits: 2; Input Offset Voltage (Vos): 2mV; Number of Channels: 2; Number of Elements: 2; Number of Amplifiers: 2; Quiescent Current: 850uA; Series: -; Technology: BIPOLAR; Length: 3.2mm; Width: 3.2mm; Height: 0.95mm; Radiation Hardening: No; REACH SVHC: No SVHC; Lead Free: Contains Lead; RoHS Compliant: Yes; ComponentLink4URL: https://datasheet.ciiva.com/1794/ad8565-8566-8567-1794356.pdf?src-supplier=Digi-Key; ComponentLink4Description: https://datasheet.ciiva.com/1794/ad8565-8566-8567-1794356.pdf?src-supplier=Digi-Key; ComponentLink5URL: https://datasheet.ciiva.com/1794/ad8565-8566-8567-1794357.pdf?src-supplier=Digi-Key; ComponentLink5Description: https://datasheet.ciiva.com/1794/ad8565-8566-8567-1794357.pdf?src-supplier=Digi-Key; ComponentLink6URL: https://datasheet.ciiva.com/1794/ad8565-8566-8567-1794358.pdf?src-supplier=Digi-Key; ComponentLink6Description: https://datasheet.ciiva.com/1794/ad8565-8566-8567-1794358.pdf?src-supplier=Digi-Key; ComponentLink7URL: https://datasheet.ciiva.com/11213/ad8565-8566-8567-11213500.pdf?src-supplier=Avnet; ComponentLink7Description: https://datasheet.ciiva.com/11213/ad8565-8566-8567-11213500.pdf?src-supplier=Avnet; ComponentLink8URL: https://datasheet.ciiva.com/17569/ad8565-8566-8567-17569704.pdf?src-supplier=Avnet+Europe; ComponentLink8Description: https://datasheet.ciiva.com/17569/ad8565-8566-8567-17569704.pdf?src-supplier=Avnet+Europe; ComponentLink9URL: https://datasheet.ciiva.com/46396/669864-46396310.pdf?src-supplier=Element14; ComponentLink9Description: https://datasheet.ciiva.com/46396/669864-46396310.pdf?src-supplier=Element14